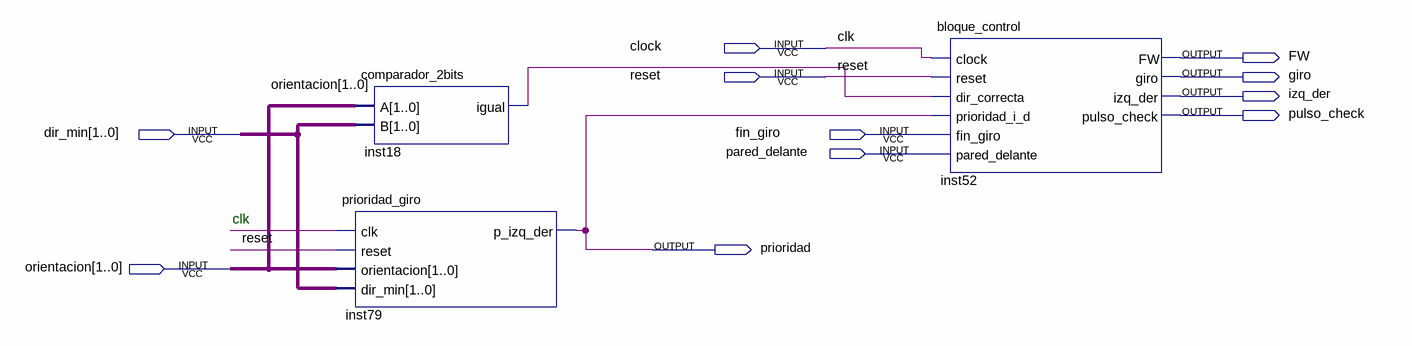
[diagram p0: schematic sheet]
// Quartus schematic conexioooon.bdf as structural Verilog: 3 symbols, 11 pins
module conexioooon (
  input  clock,
  input  reset,
  input  [1:0] dir_min,
  input  fin_giro,
  input  pared_delante,
  input  [1:0] orientacion,
  output FW,
  output giro,
  output izq_der,
  output pulso_check,
  output prioridad
);

  wire inst18_igual;

  comparador_2bits inst18 (.A(orientacion), .B(dir_min), .igual(inst18_igual));
  prioridad_giro inst79 (
    .clk(clock), .reset(reset), .orientacion(orientacion), .dir_min(dir_min), .p_izq_der(prioridad));
  bloque_control inst52 (
    .clock(clock), .reset(reset), .dir_correcta(inst18_igual), .prioridad_i_d(prioridad),
    .fin_giro(fin_giro), .pared_delante(pared_delante), .FW(FW), .giro(giro), .izq_der(izq_der),
    .pulso_check(pulso_check));

  // Other names for the same wires on the sheet: clk = clock

  // Notes on the sheet:
  //   clk
endmodule
